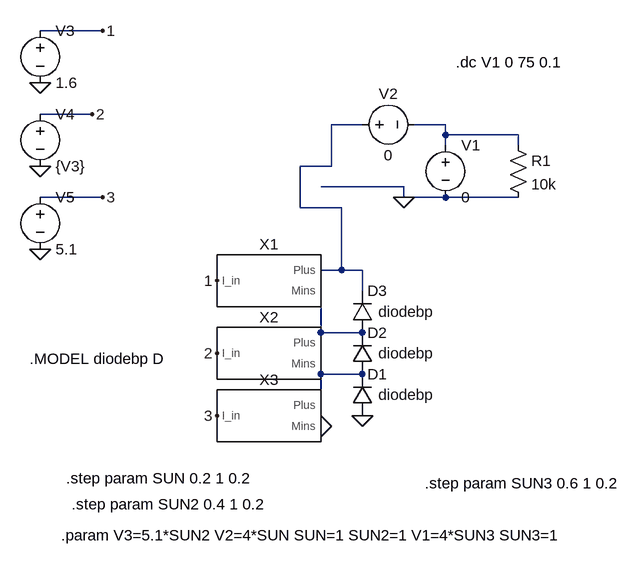
[diagram p0: schematic Draft2.asc]
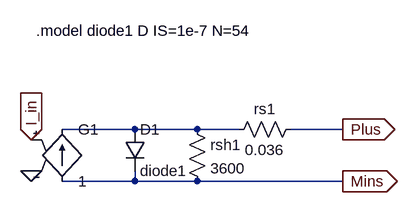
[diagram p1: sub-circuit module.asc]
Draft2.asc, the LTspice schematic file:
Version 4
SHEET 1 1168 840
WIRE 368 48 272 48
WIRE 352 176 272 176
WIRE 768 192 720 192
WIRE 896 192 848 192
WIRE 896 208 896 192
WIRE 1008 208 896 208
WIRE 896 224 896 208
WIRE 1008 224 1008 208
WIRE 720 256 720 192
WIRE 720 256 672 256
WIRE 832 288 704 288
WIRE 368 304 272 304
WIRE 832 304 832 288
WIRE 896 304 832 304
WIRE 1008 304 896 304
WIRE 672 320 672 256
WIRE 736 320 672 320
WIRE 736 416 736 320
WIRE 736 416 704 416
WIRE 768 416 736 416
WIRE 768 448 768 416
WIRE 704 512 704 448
WIRE 768 512 704 512
WIRE 704 528 704 512
WIRE 704 576 704 560
WIRE 768 576 704 576
WIRE 704 624 704 576
FLAG 832 304 0
FLAG 272 128 0
FLAG 272 256 0
FLAG 272 384 0
FLAG 368 48 1
FLAG 544 432 1
FLAG 352 176 2
FLAG 544 544 2
FLAG 544 640 3
FLAG 368 304 3
FLAG 704 656 0
FLAG 768 640 0
SYMBOL voltage 896 208 R0
WINDOW 123 0 0 Left 0
WINDOW 39 24 124 Left 2
SYMATTR InstName V1
SYMATTR Value 0
SYMBOL voltage 752 192 R270
WINDOW 0 32 56 VTop 2
WINDOW 3 -32 56 VBottom 2
SYMATTR InstName V2
SYMATTR Value 0
SYMBOL res 992 208 R0
SYMATTR InstName R1
SYMATTR Value 10k
SYMBOL voltage 272 32 R0
SYMATTR InstName V3
SYMATTR Value 1.6
SYMBOL voltage 272 160 R0
SYMATTR InstName V4
SYMATTR Value {V3}
SYMBOL voltage 272 288 R0
SYMATTR InstName V5
SYMATTR Value 5.1
SYMBOL module 624 432 R0
SYMATTR InstName X1
SYMBOL module 624 544 R0
SYMATTR InstName X2
SYMBOL module 624 640 R0
SYMATTR InstName X3
SYMBOL diode 752 640 M180
WINDOW 0 24 64 Left 2
WINDOW 3 41 32 Left 2
SYMATTR InstName D1
SYMATTR Value diodebp
SYMBOL diode 752 576 M180
WINDOW 0 24 64 Left 2
WINDOW 3 41 32 Left 2
SYMATTR InstName D2
SYMATTR Value diodebp
SYMBOL diode 752 512 M180
WINDOW 0 24 64 Left 2
WINDOW 3 41 32 Left 2
SYMATTR InstName D3
SYMATTR Value diodebp
TEXT 912 96 Left 2 !.dc V1 0 75 0.1
TEXT 256 552 Left 2 !.MODEL diodebp D
TEXT 312 736 Left 2 !.step param SUN 0.2 1 0.2
TEXT 320 776 Left 2 !.step param SUN2 0.4 1 0.2
TEXT 304 824 Left 2 !.param V3=5.1*SUN2 V2=4*SUN SUN=1 SUN2=1 V1=4*SUN3 SUN3=1
TEXT 864 744 Left 2 !.step param SUN3 0.6 1 0.2

module.asc, the sub-circuit schematic file:
Version 4
SHEET 1 880 680
WIRE 128 64 16 64
WIRE 224 64 128 64
WIRE 288 64 224 64
WIRE 448 64 368 64
WIRE 128 144 128 128
WIRE 128 144 16 144
WIRE 224 144 128 144
WIRE 448 144 224 144
FLAG -32 128 0
FLAG -32 80 I_in
IOPIN -32 80 In
FLAG 448 64 Plus
IOPIN 448 64 Out
FLAG 448 144 Mins
IOPIN 448 144 Out
SYMBOL diode 112 64 R0
SYMATTR InstName D1
SYMATTR Value diode1
SYMBOL res 208 48 R0
SYMATTR InstName rsh1
SYMATTR Value 3600
SYMBOL res 384 48 R90
WINDOW 0 0 56 VBottom 2
WINDOW 3 32 56 VTop 2
SYMATTR InstName rs1
SYMATTR Value 0.036
SYMBOL g 16 48 R0
SYMATTR InstName G1
SYMATTR Value 1
TEXT -24 -88 Left 2 !.model diode1 D IS=1e-7 N=54

The netlist it stands for:
* Draft2.asc
V1 N002 0 0
V2 N001 N002 0
R1 N002 0 10k
V3 1 0 1.6
V4 2 0 {V3}
V5 3 0 5.1
XX1 1 N001 N003 module
XX2 2 N003 N004 module
XX3 3 N004 0 module
D1 0 N004 diodebp
D2 N004 N003 diodebp
D3 N003 N001 diodebp

* block symbol definitions
.subckt module I_in Plus Mins
D1 N001 Mins diode1
rsh1 N001 Mins 3600
rs1 Plus N001 0.036
G1 Mins N001 I_in 0 1
.model diode1 D IS=1e-7 N=54
.ends module

.model D D
.lib standard.dio
.dc V1 0 75 0.1
.MODEL diodebp D
.step param SUN 0.2 1 0.2
.step param SUN2 0.4 1 0.2
.param V3=5.1*SUN2 V2=4*SUN SUN=1 SUN2=1 V1=4*SUN3 SUN3=1
.step param SUN3 0.6 1 0.2
.backanno
.end